# Altium schematic sheet LinearRegulator.SchDoc
size A4
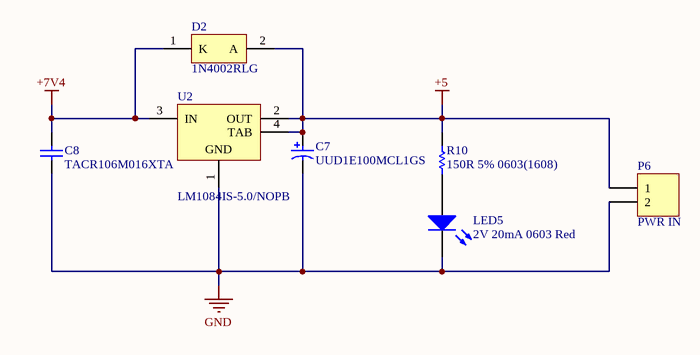
[diagram p0: LinearRegulator.SchDoc]

## Parts
C7  UUD1E100MCL1GS  [NIC-CAPA2-4X5.8_V]
C8  TACR106M016XTA  [CAPC2014X150X70NL20]
D2  1N4002RLG  [ONSC-AXIAL_LEAD-2-59-10_P]
LED5  2V 20mA 0603 Red  [0603_A]
P6  PWR IN  [HDR1X2]
R10  150R 5% 0603(1608)  [RESC0603(1608)_L]
U2  LM1084IS-5.0/NOPB  [KTT0003B_L]

## Nets
+5: C7.1 D2.2(A) P6.1 R10.2 U2.2(OUT) U2.4(TAB)
+7V4: C8.2 D2.1(K) U2.3(IN)
GND: C7.2 C8.1 LED5.1(K) P6.2 U2.1(GND)
NetLED5_2: LED5.2(A) R10.1

## Library data of the parts
C7 = CMP-0687-00016-1: Aluminum Electrolytic Capacitor, UD Series, Low Impedance, 10 uF, 25 V, + / - 20%, -55 to 105 degC, Chip Type, 4 x 5.8 mm D x L, Pb-Free, Reel; Manufacturer: Nichicon; Endurance Time: 2000 h; Packing: Dia382mm Reel; Rated Ripple Current (at 100kHz): 80 mA; Tolerance Rated Capacitance: -20 to 20%; Impedance: 1.8 Ohm; Rated Capacitance: 10 uF; Rated Voltage: 25 V; ComponentLink3URL: http://products.nichicon.co.jp/en/pdf/XJA043/e-ud.pdf; ComponentLink1Description: Manufacturer URL; DatasheetVersion: 08/2012; ComponentLink3Description: Package Specification; ComponentLink2Description: Datasheet; ComponentLink2URL: http://products.nichicon.co.jp/en/pdf/XJA043/e-ud.pdf; ComponentLink1URL: http://www.nichicon.co.jp/; Length: 5.8 mm; RoHS: TRUE; Diameter: 4 mm; Mounting Technology: Surface Mount; PackageDescription: 2-Pin Surface Mount Device, Diameter 4 mm, Height 5.8 mm, Pitch 3.6 mm; PartNumber: UUD1E100MCL1GS; PackageReference: CAPAE-D4H5.8
C8 = CMP-2007-00027-1: Manufacturer: AVX Interconnect / Elco; Part Number: TACR106M016XTA
D2 = CMP-0902-00183-1: Standard Recovery Rectifier, 2-Pin Axial_Lead, Pb-Free, Tape and Reel; Manufacturer: On Semiconductor; IO(rec) Max (A): 1; VRRM Max (V): 100; IFSM Max (A): 30; DatasheetVersion: Rev. 13; RoHS: TRUE; Packing: Tape and Reel; PackageVersion: Rev. U, 02/2005; ComponentLink3Description: Package Specification; ComponentLink1Description: Manufacturer URL; ComponentLink2Description: Datasheet; ComponentLink3URL: http://www.onsemi.cn/pub_link/Collateral/59-10.PDF; PackageDescription: 2-Pin, Axial Lead, Diameter 2.35 mm; PackageReference: AXIAL_LEAD-2-59-10; ComponentLink2URL: http://www.onsemi.com/pub_link/Collateral/1N4001-D.PDF; ComponentLink1URL: http://www.onsemi.com/; Mounting Technology: Through Hole; PartNumber: 1N4002RLG; Type: Standard Recovery
LED5 = CMP-1426-00001-1: SMD mono-color Chip LED, WL-SMCW, Red; Manufacturer: Wuerth Elektronik; PartNumber: 150060RS75000; Color: Red; PackageReference: 0603_A; ComponentLink2URL: http://katalog.we-online.com/led/datasheet/150060RS75000.pdf; ComponentLink1URL: http://www.we-online.com; ComponentLink1Description: Manufacturer URL; ComponentLink2Description: Datasheet
P6 = Header 2: Header, 2-Pin; LatestRevisionDate: 17-Jul-2002; LatestRevisionNote: Re-released for DXP Platform.; Publisher: Altium Limited
R10 = CMP-1012-00054-1: 150R 0.1W 5% 0603 (1608 Metric)  SMD; Case-EIA: 0603; Value: 150.00 Ohm; Case-Metric: 1608; Power: 0.1 W; Tolerance: 5 %; Technology: SMT
U2 = CMP-0062-00575-5: 5A Low Dropout Positive Regulators, 3-pin TO-263, Pb-Free; Manufacturer: Texas Instruments; High-Reliability: Y; PackageTopMarking: NSUZXYTTE#*LM1084*IS-5.0; CompType: LDO IC; PowerWise: N; ComponentLink1URL: http://www.ti.com/general/docs/lit/getliterature.tsp?genericPartNumber=LM1084&fileType=pdf; PinCount: 3; PackageDescription: TO-263, Molded, .400 x .390 x .180in, 3 Lead, .1in Pitch, Surface Mount; PackageReference: KTT0003B; PartNumber: LM1084IS-5.0/NOPB; Code_JEDEC: MO-169-AA; RoHS: Y; ComponentLink1Description: Datasheet URL